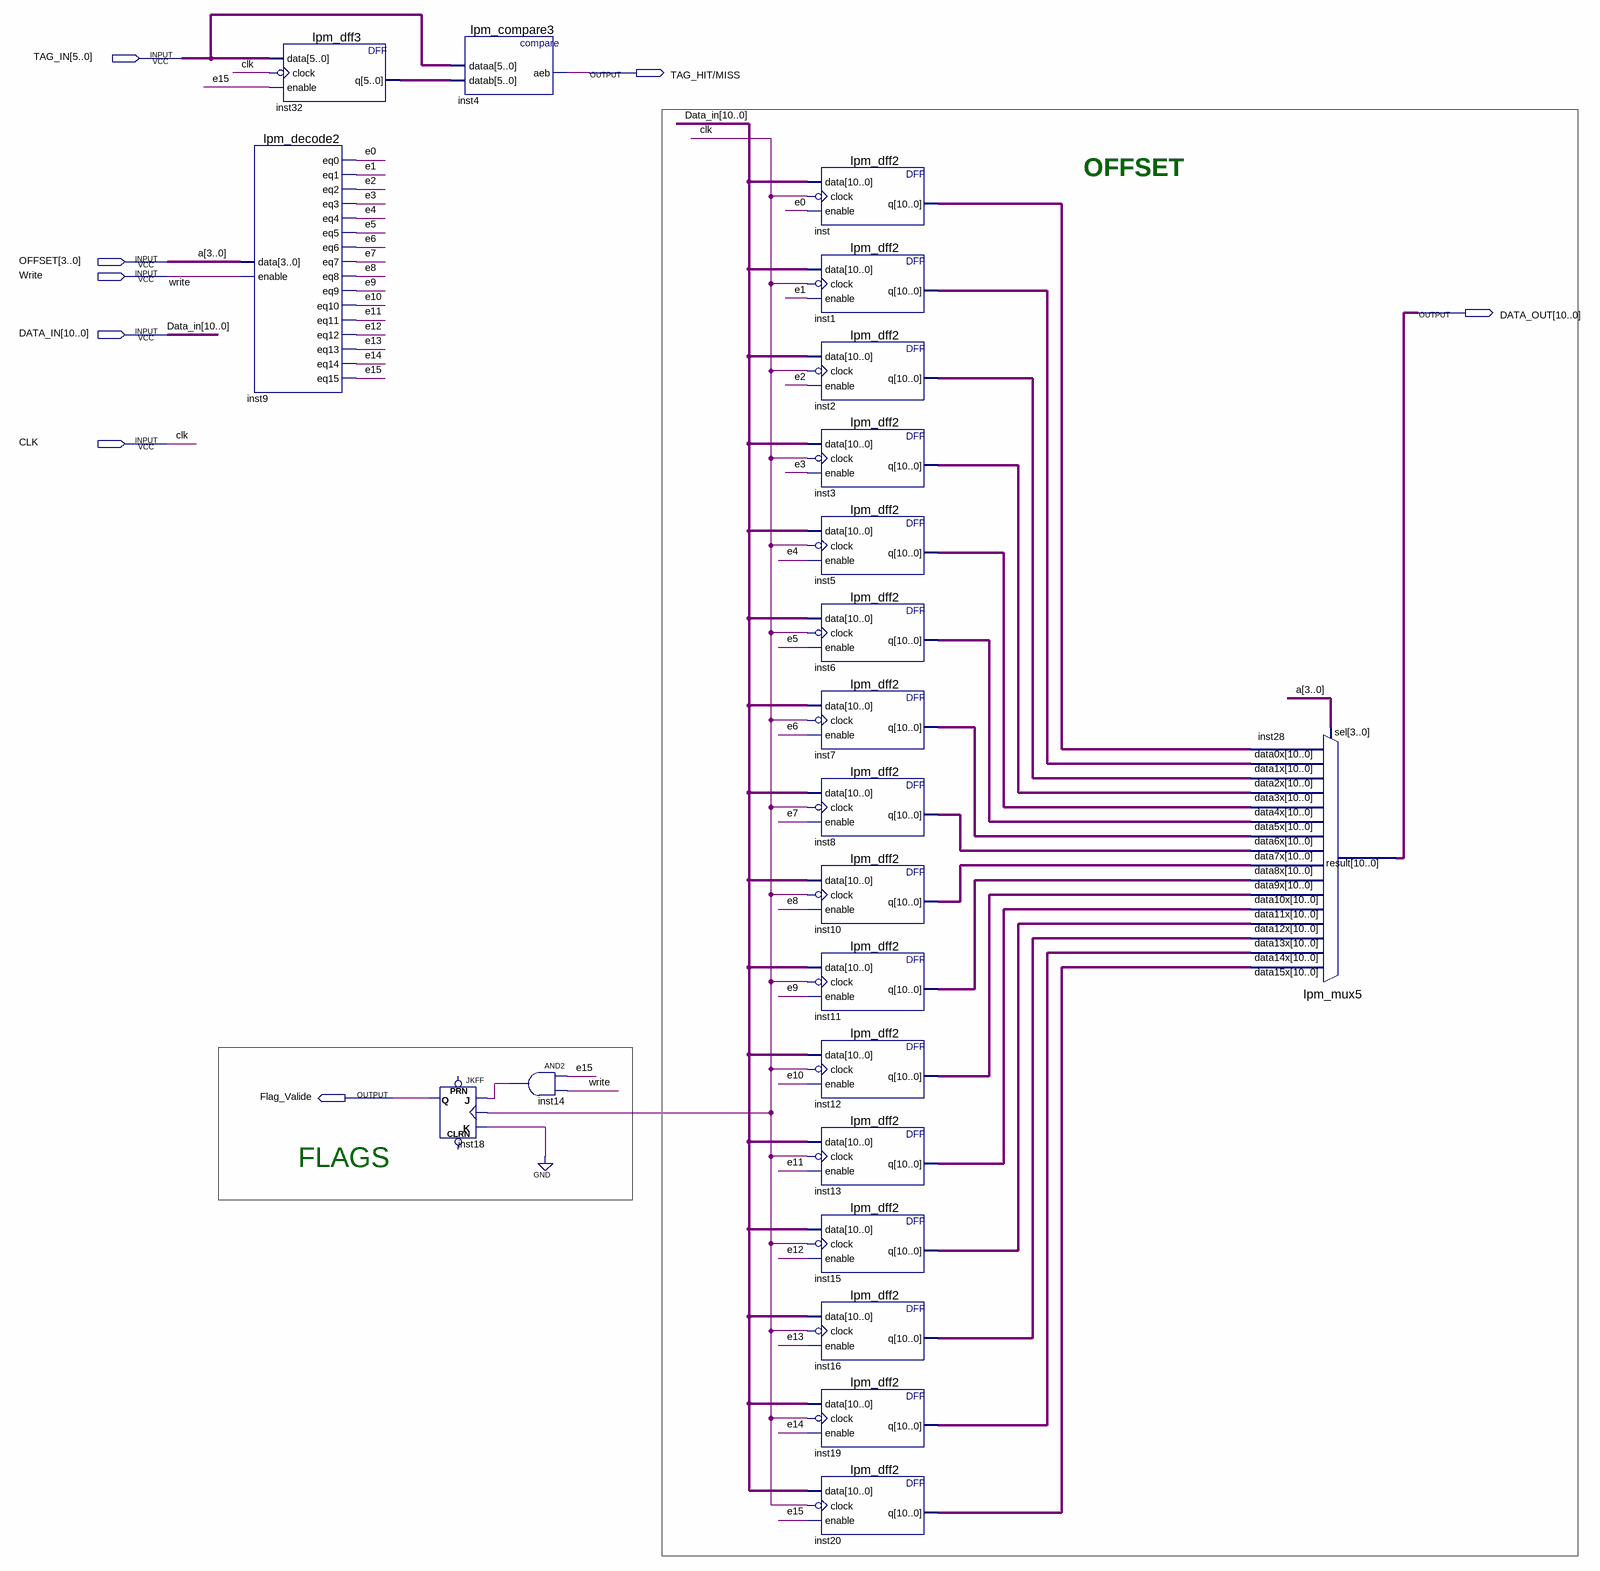
[diagram p0: schematic sheet]
// Quartus schematic String.bdf as structural Verilog: 22 symbols, 8 pins
module String (
  input  [5:0] TAG_IN,
  input  [3:0] OFFSET,
  input  Write,
  input  [10:0] DATA_IN,
  input  CLK,
  output \TAG_HIT/MISS ,
  output [10:0] DATA_OUT,
  output Flag_Valide
);

  wire e0, e1, e2, e3, e4, e5, e6, e7, e8, e9, e10, e11, e12, e13, e14, e15, inst14_out;
  wire [5:0] inst32_q;
  wire [10:0] inst1_q, inst2_q, inst3_q, inst5_q, inst6_q, inst7_q, inst8_q, inst10_q, inst11_q, inst12_q,
       inst13_q, inst15_q, inst16_q, inst19_q, inst20_q, inst_q;

  lpm_decode2 inst9 (
    .data(OFFSET), .enable(Write), .eq0(e0), .eq1(e1), .eq2(e2), .eq3(e3), .eq4(e4), .eq5(e5), .eq6(e6),
    .eq7(e7), .eq8(e8), .eq9(e9), .eq10(e10), .eq11(e11), .eq12(e12), .eq13(e13), .eq14(e14), .eq15(e15));
  lpm_dff3 inst32 (.data(TAG_IN), .clock(~CLK), .enable(e15), .q(inst32_q));
  lpm_compare3 inst4 (.dataa(TAG_IN), .datab(inst32_q), .aeb(\TAG_HIT/MISS ));
  JKFF inst18 (.K(1'b0), .J(inst14_out), .CLK(CLK), .Q(Flag_Valide));  // open: PRN, CLRN
  and inst14 (inst14_out, e15, Write);
  lpm_dff2 inst (.data(DATA_IN), .clock(~CLK), .enable(e0), .q(inst_q));
  lpm_dff2 inst1 (.data(DATA_IN), .clock(~CLK), .enable(e1), .q(inst1_q));
  lpm_dff2 inst2 (.data(DATA_IN), .clock(~CLK), .enable(e2), .q(inst2_q));
  lpm_dff2 inst3 (.data(DATA_IN), .clock(~CLK), .enable(e3), .q(inst3_q));
  lpm_dff2 inst5 (.data(DATA_IN), .clock(~CLK), .enable(e4), .q(inst5_q));
  lpm_dff2 inst6 (.data(DATA_IN), .clock(~CLK), .enable(e5), .q(inst6_q));
  lpm_dff2 inst7 (.data(DATA_IN), .clock(~CLK), .enable(e6), .q(inst7_q));
  lpm_dff2 inst8 (.data(DATA_IN), .clock(~CLK), .enable(e7), .q(inst8_q));
  lpm_dff2 inst10 (.data(DATA_IN), .clock(~CLK), .enable(e8), .q(inst10_q));
  lpm_dff2 inst11 (.data(DATA_IN), .clock(~CLK), .enable(e9), .q(inst11_q));
  lpm_dff2 inst12 (.data(DATA_IN), .clock(~CLK), .enable(e10), .q(inst12_q));
  lpm_dff2 inst13 (.data(DATA_IN), .clock(~CLK), .enable(e11), .q(inst13_q));
  lpm_dff2 inst15 (.data(DATA_IN), .clock(~CLK), .enable(e12), .q(inst15_q));
  lpm_dff2 inst16 (.data(DATA_IN), .clock(~CLK), .enable(e13), .q(inst16_q));
  lpm_dff2 inst19 (.data(DATA_IN), .clock(~CLK), .enable(e14), .q(inst19_q));
  lpm_dff2 inst20 (.data(DATA_IN), .clock(~CLK), .enable(e15), .q(inst20_q));
  lpm_mux5 inst28 (
    .data15x(inst20_q), .data14x(inst19_q), .data13x(inst16_q), .data12x(inst15_q), .data11x(inst13_q),
    .data10x(inst12_q), .data9x(inst11_q), .data8x(inst10_q), .data7x(inst8_q), .data6x(inst7_q),
    .data5x(inst6_q), .data4x(inst5_q), .data3x(inst3_q), .data2x(inst2_q), .data1x(inst1_q),
    .data0x(inst_q), .sel(OFFSET), .result(DATA_OUT));

  // Other names for the same wires on the sheet: a[3:0] = OFFSET

  // Notes on the sheet:
  //   OFFSET
  //   FLAGS
endmodule
